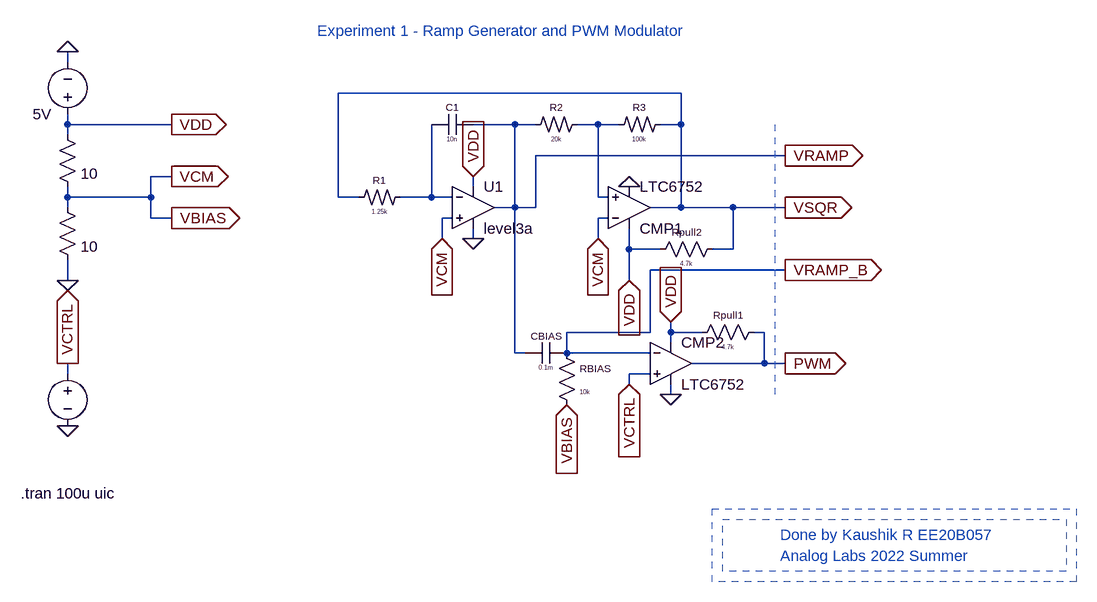
[diagram p0: schematic Exp_1_Simulation.asc]
Exp_1_Simulation.asc, the LTspice schematic file:
Version 4
SHEET 1 1172 1076
WIRE -384 256 -384 240
WIRE 560 304 32 304
WIRE -384 352 -384 336
WIRE -224 352 -384 352
WIRE 304 352 240 352
WIRE 336 352 304 352
WIRE 432 352 400 352
WIRE 464 352 432 352
WIRE 560 352 560 304
WIRE 560 352 528 352
WIRE -384 368 -384 352
WIRE 720 400 336 400
WIRE -224 432 -256 432
WIRE 240 448 240 432
WIRE -384 464 -384 448
WIRE -256 464 -256 432
WIRE -256 464 -384 464
WIRE 32 464 32 304
WIRE 64 464 32 464
WIRE 176 464 176 352
WIRE 176 464 128 464
WIRE 208 464 176 464
WIRE 432 464 432 352
WIRE 448 464 432 464
WIRE -384 480 -384 464
WIRE 304 480 304 352
WIRE 304 480 272 480
WIRE 336 480 336 400
WIRE 336 480 304 480
WIRE 560 480 560 352
WIRE 560 480 512 480
WIRE 640 480 560 480
WIRE 720 480 640 480
WIRE -256 496 -256 464
WIRE -224 496 -256 496
WIRE 208 496 192 496
WIRE 448 496 432 496
WIRE 192 528 192 496
WIRE 240 528 240 512
WIRE 432 528 432 496
WIRE 480 544 480 512
WIRE 528 544 480 544
WIRE 640 544 640 480
WIRE 640 544 608 544
WIRE 720 576 512 576
WIRE -384 592 -384 560
WIRE 480 592 480 544
WIRE 512 672 512 576
WIRE 512 672 384 672
WIRE 544 672 544 656
WIRE 592 672 544 672
WIRE 688 672 672 672
WIRE 544 688 544 672
WIRE 304 704 304 480
WIRE 320 704 304 704
WIRE 384 704 384 672
WIRE 512 704 384 704
WIRE 688 720 688 672
WIRE 688 720 576 720
WIRE 720 720 688 720
WIRE -384 736 -384 720
WIRE 512 736 480 736
WIRE 480 752 480 736
WIRE 544 768 544 752
FLAG 240 432 VDD
IOPIN 240 432 In
FLAG 544 768 0
FLAG 480 448 0
FLAG 240 528 0
FLAG 720 480 VSQR
IOPIN 720 480 Out
FLAG 720 720 PWM
IOPIN 720 720 Out
FLAG -384 592 0
FLAG -384 240 0
FLAG -224 352 VDD
IOPIN -224 352 Out
FLAG -224 432 VCM
IOPIN -224 432 Out
FLAG -224 496 VBIAS
IOPIN -224 496 Out
FLAG 480 752 VCTRL
IOPIN 480 752 In
FLAG 192 528 VCM
IOPIN 192 528 In
FLAG 432 528 VCM
IOPIN 432 528 In
FLAG 480 592 VDD
IOPIN 480 592 In
FLAG 544 656 VDD
IOPIN 544 656 In
FLAG 720 400 VRAMP
IOPIN 720 400 Out
FLAG -384 816 0
FLAG -384 720 VCTRL
IOPIN -384 720 Out
FLAG 384 784 VBIAS
IOPIN 384 784 In
FLAG 720 576 VRAMP_B
IOPIN 720 576 Out
SYMBOL res2 528 336 R90
WINDOW 0 0 32 VBottom 1
WINDOW 3 32 32 VTop 0
SYMATTR InstName R3
SYMATTR Value 100k
SYMBOL res2 128 448 R90
WINDOW 0 0 32 VBottom 1
WINDOW 3 32 32 VTop 0
SYMATTR InstName R1
SYMATTR Value 1.25k
SYMBOL cap 240 336 R90
WINDOW 0 0 32 VBottom 1
WINDOW 3 32 32 VTop 0
SYMATTR InstName C1
SYMATTR Value 10n
SYMBOL res -400 352 R0
WINDOW 0 36 40 Invisible 0
SYMATTR InstName R5
SYMATTR Value 10
SYMBOL res -400 464 R0
WINDOW 0 36 40 Invisible 0
SYMATTR InstName R6
SYMATTR Value 10
SYMBOL voltage -384 352 R180
WINDOW 0 24 96 Invisible 2
WINDOW 3 24 16 Left 2
SYMATTR InstName VDD
SYMATTR Value 5V
SYMBOL res2 400 336 R90
WINDOW 0 0 32 VBottom 1
WINDOW 3 32 32 VTop 0
SYMATTR InstName R2
SYMATTR Value 20k
SYMBOL res 576 688 R270
WINDOW 0 32 56 VTop 1
WINDOW 3 0 56 VBottom 0
SYMATTR InstName Rpull1
SYMATTR Value 4.7k
SYMBOL voltage -384 720 R0
WINDOW 3 88 31 Invisible 0
WINDOW 0 24 16 Invisible 2
WINDOW 123 0 0 Left 0
SYMATTR Value 2.5
SYMATTR InstName VCTRL
SYMATTR SpiceLine Rser=1u
SYMBOL cap 384 688 R90
WINDOW 0 0 32 VBottom 1
WINDOW 3 32 32 VTop 0
SYMATTR InstName CBIAS
SYMATTR Value 0.1m
SYMBOL res 368 688 R0
WINDOW 0 36 40 Left 1
WINDOW 3 36 76 Left 0
SYMATTR InstName RBIAS
SYMATTR Value 10k
SYMBOL res 624 528 R90
WINDOW 0 0 56 VBottom 1
WINDOW 3 32 56 VTop 0
SYMATTR InstName Rpull2
SYMATTR Value 4.7k
SYMBOL Comparators/LTC6752 544 656 R0
SYMATTR InstName CMP2
SYMBOL Comparators/LTC6752 480 544 M180
SYMATTR InstName CMP1
SYMBOL OpAmps\\UniversalOpAmp3 240 480 R0
SYMATTR InstName U1
TEXT 0 208 Left 2 ;Experiment 1 - Ramp Generator and PWM Modulator
TEXT -456 920 Left 2 !.tran 100u uic
TEXT 712 984 Left 2 ;Done by Kaushik R EE20B057
TEXT 712 1016 Left 2 ;Analog Labs 2022 Summer
LINE Normal 704 352 704 768 1
RECTANGLE Normal 1168 1056 608 944 2
RECTANGLE Normal 1152 1040 624 960 2

The netlist it stands for:
* Exp_1_Simulation.asc
R3 VSQR N001 100k
R1 N002 VSQR 1.25k
C1 VRAMP N002 10n
R5 VDD VBIAS 10
R6 VBIAS 0 10
VDD VDD 0 5V
R2 N001 VRAMP 20k
Rpull1 VDD PWM 4.7k
VCTRL VCTRL 0 2.5 Rser=1u
CBIAS VRAMP_B VRAMP 0.1m
RBIAS VRAMP_B VBIAS 10k
Rpull2 VSQR VDD 4.7k
XCMP2 VCTRL VRAMP_B VDD 0 PWM LTC6752  ; pins In+ In- V+ V- OUT
XCMP1 N001 VBIAS VDD 0 VSQR LTC6752  ; pins In+ In- V+ V- OUT
XU1 VBIAS N002 VDD 0 VRAMP level3a  ; pins In+ In- V+ V- OUT
* Experiment 1 - Ramp Generator and PWM Modulator
.tran 100u uic
* Done by Kaushik R EE20B057
* Analog Labs 2022 Summer
.lib LTC7.lib
.backanno
.end

* Results of the author's LTspice run, read from the files saved beside the schematic
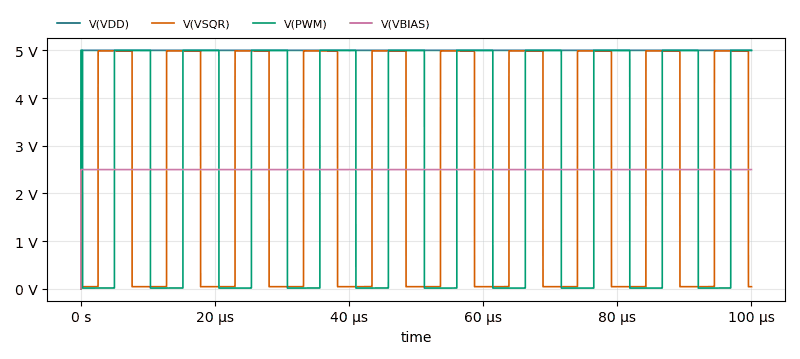
[diagram p1: Transient Analysis of Exp_1_Simulation.asc, plotted from the saved traces]
* Transient Analysis, 1 run:
*   V(VDD): min 0 V, max 5 V, average 5 V, rms 5 V, last 5 V
*   V(VSQR): min 0 V, max 4.989 V, average 2.553 V, rms 3.553 V, last 43.5 mV
*   V(PWM): min 0 V, max 5 V, average 2.589 V, rms 3.592 V, last 5 V
*   V(VBIAS): min 0 V, max 2.5 V, average 2.5 V, rms 2.5 V, last 2.5 V